# Altium project PCB_Two.PrjPCB
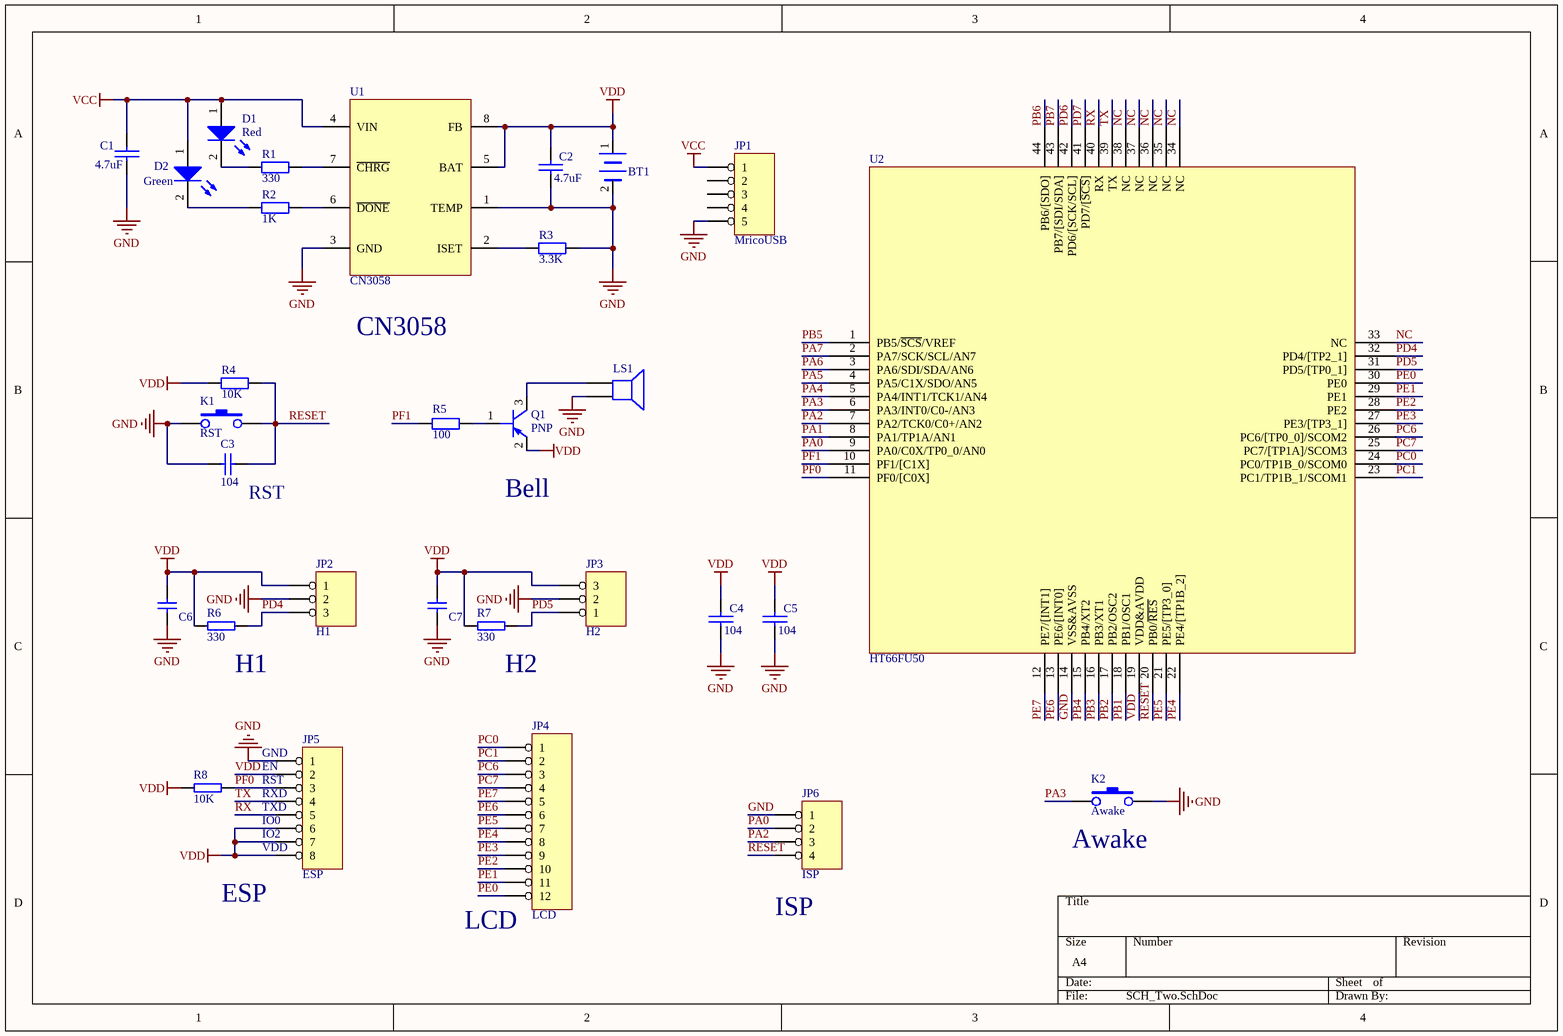
[diagram p0: SCH_Two.SchDoc]
1 sheet, 30 parts. Net scope: global (net labels, ports and power ports of the same name join across sheets).
Board file: PCB_Two.PcbDoc

## Sheet SCH_Two.SchDoc
size A4

### Parts
BT1  BATTERY_1  [AAA Battery]  (value not drawn)
C1  4.7uF  [0805]
C2  4.7uF  [0805]
C3  value 104  [0603]  (hidden comment: Cap)
C4  104  [0603]
C5  104  [0603]
C6  CAP_1  [0603]  (value not drawn)
C7  CAP_1  [0603]  (value not drawn)
D1  Red  [0603]
D2  Green  [0603]
JP1  MricoUSB  [MircoUSB]
JP2  H1  [A3144]
JP3  H2  [A3144]
JP4  LCD  [LCD1621]
JP5  ESP  [ESP8266-11]
JP6  ISP  [SIP4]
K1  RST  [KEY-SMT]
K2  Awake  [KEY-SMT]
LS1  SPEAKER  [Buzzer-Small]  (value not drawn)
Q1  PNP  [SOT-23]
R1  330  [0603]
R2  1K  [0603]
R3  3.3K  [0603]
R4  value 10K  [0603]  (hidden comment: Res1)
R5  100  [0603]
R6  330  [0603]
R7  330  [0603]
R8  10K  [0603]
U1  CN3058  [SO-8]
U2  HT66FU50  [LQFP44]

### Nets
GND: BT1.2(-) C1.1 C2.1 C3.1 C4.1 C5.1 C6.1 C7.1 JP1.5 JP2.2 JP3.2 JP5.1 JP6.1 K1.1 K2.2 LS1.2 R3.2 U1.1(TEMP) U1.3(GND) U2.14(VSS&AVSS)
VCC: C1.2 D1.1(A) D2.1(A) JP1.1 U1.4(VIN)
VDD: BT1.1(+) C2.2 C4.2 C5.2 C6.2 C7.2 JP2.1 JP3.3 JP5.2 JP5.6 JP5.7 JP5.8 Q1.2(EMITTER) R4.1 R6.1 R7.1 R8.1 U1.5(BAT) U1.8(FB) U2.19(VDD&AVDD)
NC: U2.33(NC) U2.34(NC) U2.35(NC) U2.36(NC) U2.37(NC) U2.38(NC)
PA0: JP6.2 U2.9(PA0/C0X/TP0_0/AN0)
PA1: U2.8(PA1/TP1A/AN1)
PA2: JP6.3 U2.7(PA2/TCK0/C0+/AN2)
PA3: K2.1 U2.6(PA3/INT0/C0-/AN3)
PA4: U2.5(PA4/INT1/TCK1/AN4)
PA5: U2.4(PA5/C1X/SDO/AN5)
PA6: U2.3(PA6/SDI/SDA/AN6)
PA7: U2.2(PA7/SCK/SCL/AN7)
PB1: U2.18(PB1/OSC1)
PB2: U2.17(PB2/OSC2)
PB3: U2.16(PB3/XT1)
PB4: U2.15(PB4/XT2)
PB5: U2.1(PB5/~{SCS}/VREF)
PB6: U2.44(PB6/[SDO])
PB7: U2.43(PB7/[SDI/SDA])
PC0: JP4.1 U2.24(PC0/TP1B_0/SCOM0)
PC1: JP4.2 U2.23(PC1/TP1B_1/SCOM1)
PC6: JP4.3 U2.26(PC6/[TP0_0]/SCOM2)
PC7: JP4.4 U2.25(PC7/[TP1A]/SCOM3)
PD4: JP2.3 R6.2 U2.32(PD4/[TP2_1])
PD5: JP3.1 R7.2 U2.31(PD5/[TP0_1])
PD6: U2.42(PD6/[SCK/SCL])
PD7: U2.41(PD7/[~{SCS}])
PE0: JP4.12 U2.30(PE0)
PE1: JP4.11 U2.29(PE1)
PE2: JP4.10 U2.28(PE2)
PE3: JP4.9 U2.27(PE3/[TP3_1])
PE4: JP4.8 U2.22(PE4/[TP1B_2])
PE5: JP4.7 U2.21(PE5/[TP3_0])
PE6: JP4.6 U2.13(PE6/[INT0])
PE7: JP4.5 U2.12(PE7/[INT1])
PF0: JP5.3 R8.2 U2.11(PF0/[C0X])
PF1: R5.2 U2.10(PF1/[C1X])
RESET: C3.2 JP6.4 K1.2 R4.2 U2.20(PB0/~{RES})
RX: JP5.5 U2.40(RX)
TX: JP5.4 U2.39(TX)
NetD1_2: D1.2(K) R1.1
NetD2_2: D2.2(K) R2.1
NetLS1_1: LS1.1 Q1.3(COLLECTOR)
NetQ1_1: Q1.1(BASE) R5.1
NetR1_2: R1.2 U1.7(~{CHRG})
NetR2_2: R2.2 U1.6(~{DONE})
NetR3_1: R3.1 U1.2(ISET)

Not connected (* = marked no-connect by the designer): JP1 2 3 4

### Notes on the sheet
- CN3058
- (near C3) RST
- (near Q1) Bell
- (near R6) H1
- (near R7) H2
- (near JP5) GND
- EN
- (near JP5) RST
- (near JP5) RXD
- (near JP5) TXD
- (near JP5) IO0
- (near JP5) IO2
- (near JP5) VDD
- (near K2) Awake
- (near JP5) ESP
- (near JP6) ISP
- (near JP4) LCD

### Library data of the parts
BT1 = BATTERY_1: Battery
C1 C2 C4 C5 = CAP1: Value: *
C3 = Cap: 无极性电容; Published: 8-Jun-2000; LatestRevisionDate: 17-Jul-2002; LatestRevisionNote: Re-released for DXP Platform.; PackageReference: RAD-0.3; Publisher: Altium Limited
C6 C7 = CAP_1: Capacitor
D1 D2 = LED: LED灯
JP1 = HEADER 5
JP2 JP3 = HEADER 3
JP4 = HEADER 12
JP5 = HEADER 8
JP6 = HEADER 4
K1 K2 = SW-PB_1: key
Q1 = PNP: PNP Transistor
R1-R3 R5 = Res2: 电阻; Value: *
R4 = Res1: 贴片电阻; Published: 8-Jun-2000; LatestRevisionDate: 17-Jul-2002; LatestRevisionNote: Re-released for DXP Platform.; PackageReference: AXIAL-0.4; Publisher: Altium Limited
R6-R8 = RES2: Resistor
U1 = CN3058: Name: *
U2 = HT66FU50: Name: HT66FU50